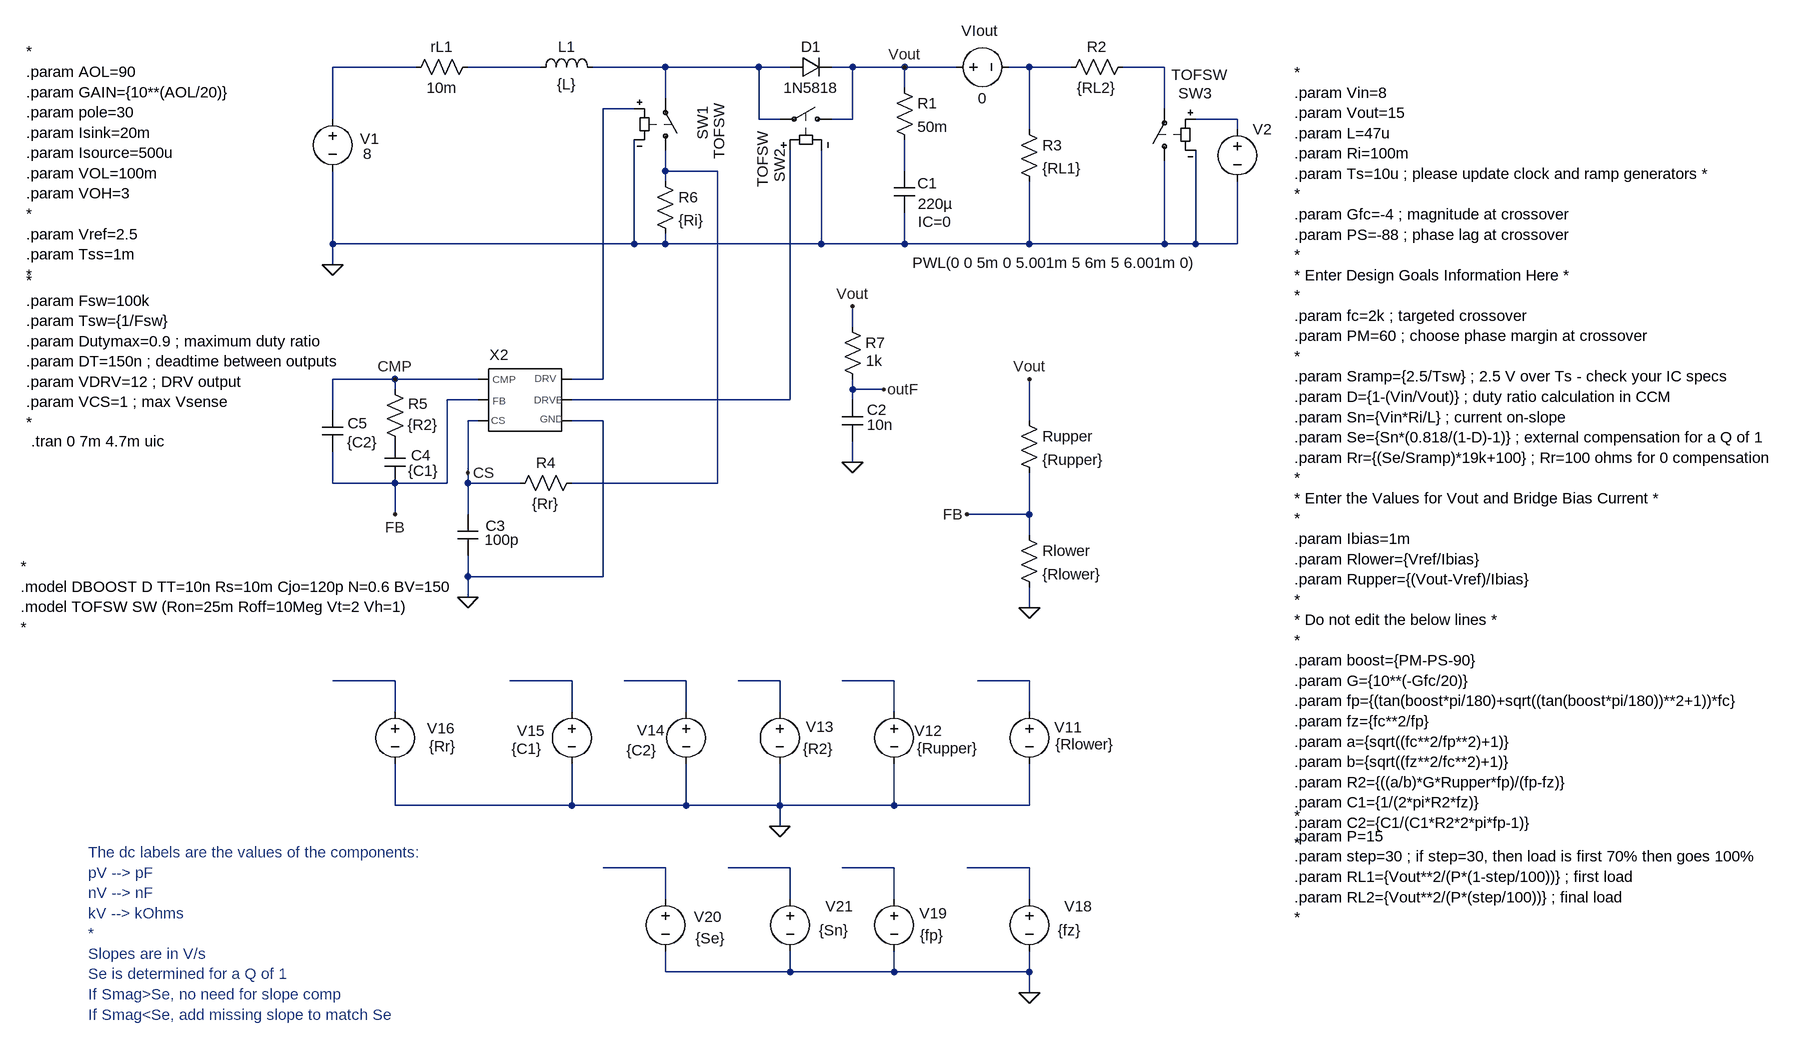
[diagram p0: schematic Boost Synchro CM - cbc - load step.asc]
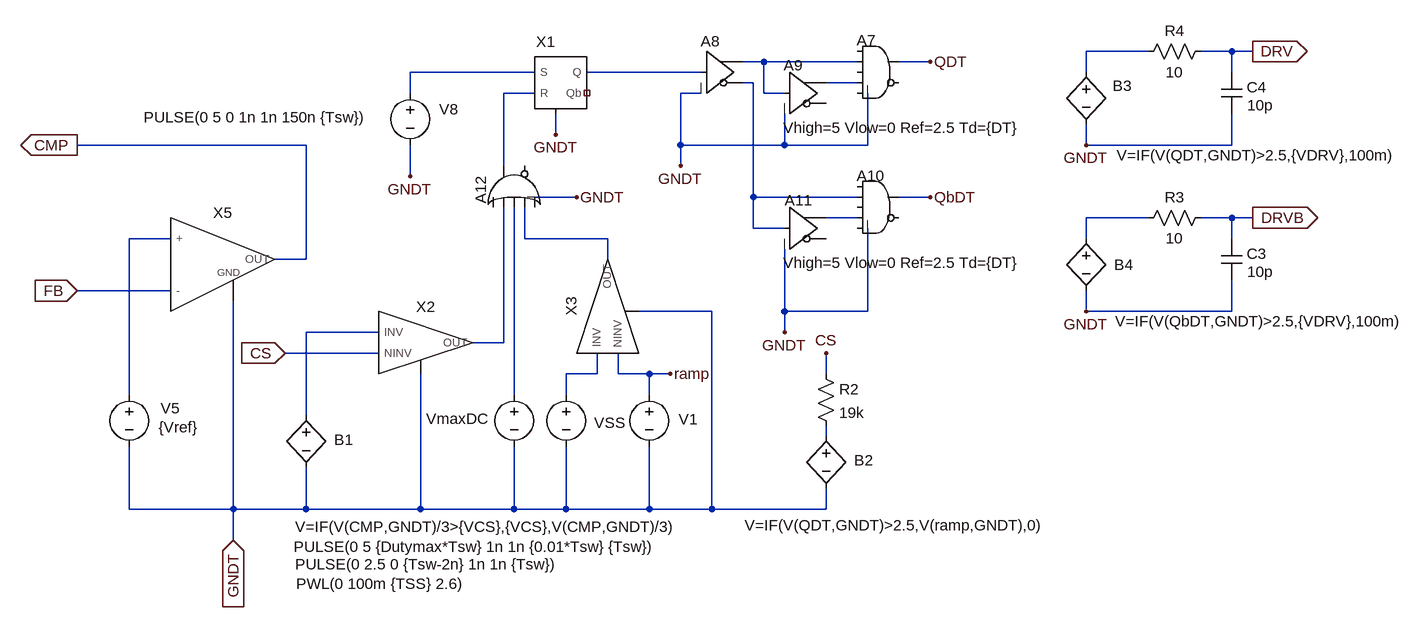
[diagram p1: sub-circuit generic_cm_pwm.asc]
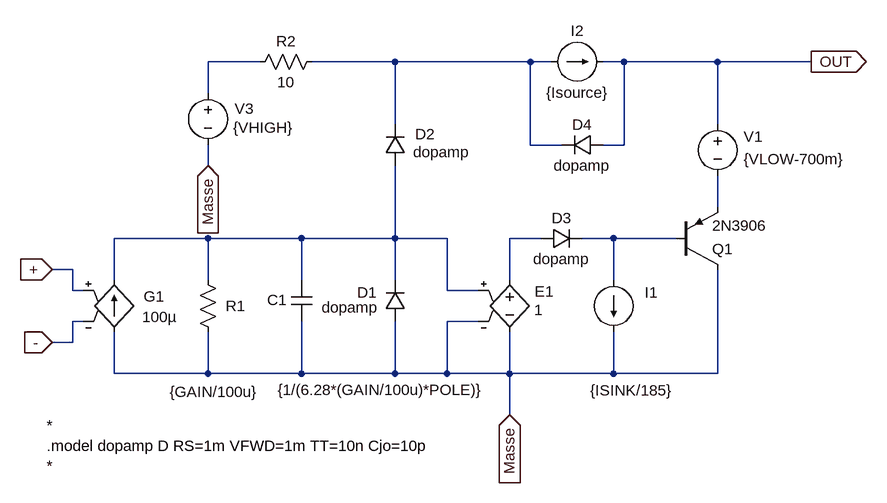
[diagram p2: sub-circuit op_amp_fan_out.asc]
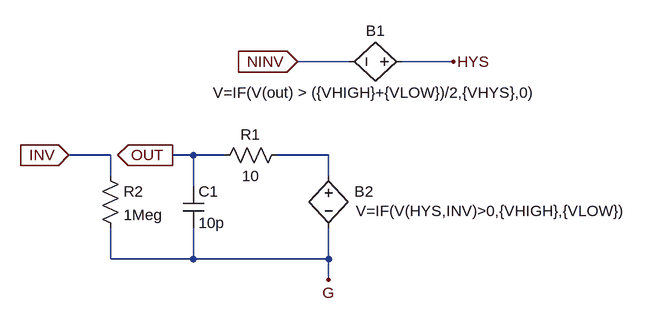
[diagram p3: sub-circuit comptof_g.asc]
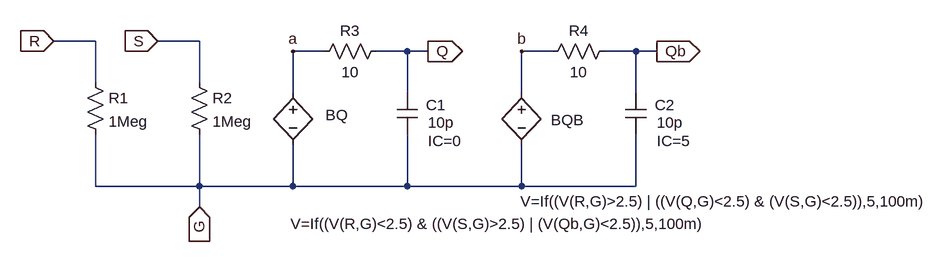
[diagram p4: sub-circuit sr_latch_g.asc]
Boost Synchro CM - cbc - load step.asc, the LTspice schematic file:
Version 4.1
SHEET 1 3080 1960
WIRE -16 224 -144 224
WIRE 176 224 64 224
WIRE 368 224 256 224
WIRE 512 224 368 224
WIRE 560 224 512 224
WIRE 656 224 624 224
WIRE 736 224 656 224
WIRE 816 224 736 224
WIRE 928 224 896 224
WIRE 992 224 928 224
WIRE 1136 224 1072 224
WIRE 736 256 736 224
WIRE 368 272 368 224
WIRE 320 288 272 288
WIRE 1136 288 1136 224
WIRE -144 304 -144 224
WIRE 512 304 512 224
WIRE 544 304 512 304
WIRE 656 304 656 224
WIRE 656 304 624 304
WIRE 1248 304 1184 304
WIRE 928 320 928 224
WIRE 1248 320 1248 304
WIRE 368 384 368 352
WIRE 448 384 368 384
WIRE 736 384 736 336
WIRE 368 400 368 384
WIRE -144 496 -144 384
WIRE 320 496 320 336
WIRE 320 496 -144 496
WIRE 368 496 368 480
WIRE 368 496 320 496
WIRE 608 496 608 352
WIRE 608 496 368 496
WIRE 736 496 736 448
WIRE 736 496 608 496
WIRE 928 496 928 400
WIRE 928 496 736 496
WIRE 1136 496 1136 368
WIRE 1136 496 928 496
WIRE 1184 496 1184 352
WIRE 1184 496 1136 496
WIRE 1248 496 1248 400
WIRE 1248 496 1184 496
WIRE -144 528 -144 496
WIRE 656 624 656 592
WIRE -48 704 -144 704
WIRE 80 704 -48 704
WIRE 272 704 272 288
WIRE 272 704 224 704
WIRE -48 720 -48 704
WIRE 656 720 656 704
WIRE 704 720 656 720
WIRE 80 736 32 736
WIRE 560 736 560 352
WIRE 560 736 224 736
WIRE 656 736 656 720
WIRE -144 752 -144 704
WIRE 80 768 64 768
WIRE 272 768 224 768
WIRE 928 768 928 704
WIRE 656 832 656 800
WIRE 64 848 64 768
WIRE -144 864 -144 816
WIRE -48 864 -144 864
WIRE 32 864 32 736
WIRE 32 864 -48 864
WIRE 64 864 64 848
WIRE 144 864 64 864
WIRE 448 864 448 384
WIRE 448 864 224 864
WIRE -48 912 -48 864
WIRE 64 912 64 864
WIRE 928 912 928 848
WIRE 928 912 832 912
WIRE 928 944 928 912
WIRE 64 1008 64 976
WIRE 272 1008 272 768
WIRE 272 1008 64 1008
WIRE 64 1040 64 1008
WIRE 928 1056 928 1024
WIRE -48 1168 -144 1168
WIRE 224 1168 128 1168
WIRE 400 1168 304 1168
WIRE 544 1168 480 1168
WIRE 720 1168 640 1168
WIRE 928 1168 848 1168
WIRE -48 1216 -48 1168
WIRE 224 1216 224 1168
WIRE 400 1216 400 1168
WIRE 544 1216 544 1168
WIRE 720 1216 720 1168
WIRE 928 1216 928 1168
WIRE -48 1360 -48 1296
WIRE 224 1360 224 1296
WIRE 224 1360 -48 1360
WIRE 400 1360 400 1296
WIRE 400 1360 224 1360
WIRE 544 1360 544 1296
WIRE 544 1360 400 1360
WIRE 720 1360 720 1296
WIRE 720 1360 544 1360
WIRE 928 1360 928 1296
WIRE 928 1360 720 1360
WIRE 544 1392 544 1360
WIRE 368 1456 272 1456
WIRE 560 1456 464 1456
WIRE 720 1456 640 1456
WIRE 928 1456 832 1456
WIRE 368 1504 368 1456
WIRE 560 1504 560 1456
WIRE 720 1504 720 1456
WIRE 928 1504 928 1456
WIRE 368 1616 368 1584
WIRE 560 1616 560 1584
WIRE 560 1616 368 1616
WIRE 720 1616 720 1584
WIRE 720 1616 560 1616
WIRE 928 1616 928 1584
WIRE 928 1616 720 1616
WIRE 928 1648 928 1616
FLAG -144 528 0
FLAG 928 1056 0
FLAG 928 704 Vout
FLAG 832 912 FB
FLAG 736 224 Vout
FLAG -48 912 FB
FLAG -48 704 CMP
FLAG 64 1040 0
FLAG 64 848 CS
FLAG 544 1392 0
FLAG 928 1648 0
FLAG 656 592 Vout
FLAG 656 832 0
FLAG 704 720 outF
DATAFLAG 144 1168 ""
DATAFLAG 336 1168 ""
DATAFLAG 512 1168 ""
DATAFLAG 656 1168 ""
DATAFLAG 880 1168 ""
DATAFLAG -112 1168 ""
DATAFLAG 848 1456 ""
DATAFLAG 688 1456 ""
DATAFLAG 304 1456 ""
DATAFLAG 480 1456 ""
SYMBOL sw 368 368 M180
WINDOW 3 83 89 VLeft 2
WINDOW 0 57 84 VLeft 2
SYMATTR Value TOFSW
SYMATTR InstName SW1
SYMBOL voltage -144 288 R0
WINDOW 0 42 46 Left 2
WINDOW 3 47 69 Left 2
SYMATTR InstName V1
SYMATTR Value 8
SYMBOL diode 560 240 R270
WINDOW 0 32 32 VTop 2
WINDOW 3 0 32 VBottom 2
SYMATTR InstName D1
SYMATTR Value 1N5818
SYMBOL res 80 208 R90
WINDOW 0 0 56 VBottom 2
WINDOW 3 32 56 VTop 2
SYMATTR InstName rL1
SYMATTR Value 10m
SYMBOL ind 160 240 R270
WINDOW 0 32 56 VTop 2
WINDOW 3 5 56 VBottom 2
SYMATTR InstName L1
SYMATTR Value {L}
SYMBOL res 720 240 R0
SYMATTR InstName R1
SYMATTR Value 50m
SYMBOL cap 720 384 R0
WINDOW 0 36 19 Left 2
WINDOW 3 37 50 Left 2
WINDOW 123 37 78 Left 2
SYMATTR InstName C1
SYMATTR Value 220µ
SYMATTR Value2 IC=0
SYMBOL res 912 304 R0
SYMATTR InstName R3
SYMATTR Value {RL1}
SYMBOL voltage 800 224 R270
WINDOW 0 40 52 VTop 2
WINDOW 3 -32 56 VBottom 2
SYMATTR InstName VIout
SYMATTR Value 0
SYMBOL res 912 928 R0
SYMATTR InstName Rlower
SYMATTR Value {Rlower}
SYMBOL res 912 752 R0
SYMATTR InstName Rupper
SYMATTR Value {Rupper}
SYMBOL res 240 848 R90
WINDOW 0 0 56 VBottom 2
WINDOW 3 32 56 VTop 2
SYMATTR InstName R4
SYMATTR Value {Rr}
SYMBOL cap 48 912 R0
WINDOW 0 43 18 Left 2
WINDOW 3 42 39 Left 2
SYMATTR InstName C3
SYMATTR Value 100p
SYMBOL cap -64 800 R0
WINDOW 0 41 21 Left 2
WINDOW 3 36 45 Left 2
SYMATTR InstName C4
SYMATTR Value {C1}
SYMBOL res -64 704 R0
WINDOW 0 36 38 Left 2
WINDOW 3 35 70 Left 2
SYMATTR InstName R5
SYMATTR Value {R2}
SYMBOL cap -160 752 R0
WINDOW 0 39 20 Left 2
WINDOW 3 38 49 Left 2
SYMATTR InstName C5
SYMATTR Value {C2}
SYMBOL sw 640 304 M270
WINDOW 3 -18 122 Right 2
WINDOW 0 -46 96 Right 2
SYMATTR Value TOFSW
SYMATTR InstName SW2
SYMBOL res 352 384 R0
SYMATTR InstName R6
SYMATTR Value {Ri}
SYMBOL voltage 928 1200 R0
WINDOW 0 39 40 Left 2
WINDOW 3 40 66 Left 2
WINDOW 123 0 0 Left 0
WINDOW 39 0 0 Left 0
SYMATTR InstName V11
SYMATTR Value {Rlower}
SYMBOL voltage 720 1200 R0
WINDOW 0 31 45 Left 2
WINDOW 3 35 72 Left 2
WINDOW 123 0 0 Left 0
WINDOW 39 0 0 Left 0
SYMATTR InstName V12
SYMATTR Value {Rupper}
SYMBOL voltage 544 1200 R0
WINDOW 0 40 39 Left 2
WINDOW 3 36 73 Left 2
WINDOW 123 0 0 Left 0
WINDOW 39 0 0 Left 0
SYMATTR InstName V13
SYMATTR Value {R2}
SYMBOL voltage 400 1200 R0
WINDOW 0 -76 44 Left 2
WINDOW 3 -92 75 Left 2
SYMATTR InstName V14
SYMATTR Value {C2}
SYMBOL voltage 224 1200 R0
WINDOW 0 -84 45 Left 2
WINDOW 3 -93 73 Left 2
WINDOW 123 0 0 Left 0
WINDOW 39 0 0 Left 0
SYMATTR InstName V15
SYMATTR Value {C1}
SYMBOL voltage -48 1200 R0
WINDOW 0 49 41 Left 2
WINDOW 3 52 69 Left 2
SYMATTR InstName V16
SYMATTR Value {Rr}
SYMBOL voltage 928 1488 R0
WINDOW 0 54 27 Left 2
WINDOW 3 44 64 Left 2
WINDOW 123 0 0 Left 0
WINDOW 39 0 0 Left 0
SYMATTR InstName V18
SYMATTR Value {fz}
SYMBOL voltage 720 1488 R0
WINDOW 0 39 38 Left 2
WINDOW 3 40 72 Left 2
SYMATTR InstName V19
SYMATTR Value {fp}
SYMBOL voltage 368 1488 R0
WINDOW 0 44 43 Left 2
WINDOW 3 46 76 Left 2
SYMATTR InstName V20
SYMATTR Value {Se}
SYMBOL voltage 560 1488 R0
WINDOW 0 54 27 Left 2
WINDOW 3 44 64 Left 2
WINDOW 123 0 0 Left 0
WINDOW 39 0 0 Left 0
SYMATTR InstName V21
SYMATTR Value {Sn}
SYMBOL res 1088 208 R90
WINDOW 0 0 56 VBottom 2
WINDOW 3 32 56 VTop 2
SYMATTR InstName R2
SYMATTR Value {RL2}
SYMBOL sw 1136 384 R180
WINDOW 3 -98 148 Left 2
WINDOW 0 -73 120 Left 2
SYMATTR Value TOFSW
SYMATTR InstName SW3
SYMBOL voltage 1248 304 R0
WINDOW 3 -500 221 Left 2
WINDOW 123 0 0 Left 0
WINDOW 39 0 0 Left 0
SYMATTR Value PWL(0 0 5m 0 5.001m 5 6m 5 6.001m 0)
SYMATTR InstName V2
SYMBOL res 640 608 R0
WINDOW 3 37 68 Left 2
SYMATTR Value 1k
SYMATTR InstName R7
SYMBOL cap 640 736 R0
WINDOW 0 38 15 Left 2
WINDOW 3 38 38 Left 2
SYMATTR InstName C2
SYMATTR Value 10n
SYMBOL TOF\\Subcircuits\\Generic_CM_PWM 144 704 R0
WINDOW 0 -32 -22 Bottom 2
SYMATTR InstName X2
SYMATTR SpiceLine gain={gain} pole={pole} Isink={Isink} Isource={Isource} Vlow={VOL} Vhigh={VOH}
TEXT -624 992 Left 2 !*\n.model DBOOST D TT=10n Rs=10m Cjo=120p N=0.6 BV=150\n.model TOFSW SW (Ron=25m Roff=10Meg Vt=2 Vh=1)\n*
TEXT -608 800 Left 2 !.tran 0 7m 4.7m uic
TEXT 1336 232 Left 2 !*\n.param Vin=8\n.param Vout=15\n.param L=47u\n.param Ri=100m\n.param Ts=10u ; please update clock and ramp generators *\n*\n.param Gfc=-4 ; magnitude at crossover\n.param PS=-88 ; phase lag at crossover\n*\n* Enter Design Goals Information Here *\n*\n.param fc=2k ; targeted crossover\n.param PM=60 ; choose phase margin at crossover\n*\n.param Sramp={2.5/Tsw} ; 2.5 V over Ts - check your IC specs\n.param D={1-(Vin/Vout)} ; duty ratio calculation in CCM\n.param Sn={Vin*Ri/L} ; current on-slope\n.param Se={Sn*(0.818/(1-D)-1)} ; external compensation for a Q of 1\n.param Rr={(Se/Sramp)*19k+100} ; Rr=100 ohms for 0 compensation\n*\n* Enter the Values for Vout and Bridge Bias Current *\n*\n.param Ibias=1m\n.param Rlower={Vref/Ibias}\n.param Rupper={(Vout-Vref)/Ibias}\n*\n* Do not edit the below lines *\n*\n.param boost={PM-PS-90}\n.param G={10**(-Gfc/20)}\n.param fp={(tan(boost*pi/180)+sqrt((tan(boost*pi/180))**2+1))*fc}\n.param fz={fc**2/fp}\n.param a={sqrt((fc**2/fp**2)+1)}\n.param b={sqrt((fz**2/fc**2)+1)}\n.param R2={((a/b)*G*Rupper*fp)/(fp-fz)}\n.param C1={1/(2*pi*R2*fz)}\n.param C2={C1/(C1*R2*2*pi*fp-1)}\n*
TEXT -520 1432 Left 2 ;The dc labels are the values of the components:\npV --> pF\nnV --> nF\nkV --> kOhms\n*\nSlopes are in V/s\nSe is determined for a Q of 1\nIf Smag>Se, no need for slope comp\nIf Smag<Se, add missing slope to match Se
TEXT -616 552 Left 2 !*\n.param Fsw=100k\n.param Tsw={1/Fsw}\n.param Dutymax=0.9 ; maximum duty ratio\n.param DT=150n ; deadtime between outputs\n.param VDRV=12 ; DRV output\n.param VCS=1 ; max Vsense\n*
TEXT -616 200 Left 2 !* \n.param AOL=90\n.param GAIN={10**(AOL/20)}\n.param pole=30\n.param Isink=20m\n.param Isource=500u\n.param VOL=100m\n.param VOH=3\n*\n.param Vref=2.5\n.param Tss=1m\n*
TEXT 1336 1376 Left 2 !*\n.param P=15\n.param step=30 ; if step=30, then load is first 70% then goes 100%\n.param RL1={Vout**2/(P*(1-step/100))} ; first load\n.param RL2={Vout**2/(P*(step/100))} ; final load\n*

generic_cm_pwm.asc, the sub-circuit schematic file:
Version 4.1
SHEET 1 1744 1720
WIRE 448 816 352 816
WIRE 576 816 528 816
WIRE 608 816 576 816
WIRE -144 832 -176 832
WIRE 0 832 -144 832
WIRE 112 832 64 832
WIRE -496 848 -688 848
WIRE -240 848 -416 848
WIRE 352 848 352 816
WIRE 576 848 576 816
WIRE -160 864 -176 864
WIRE 0 864 -48 864
WIRE -688 880 -688 848
WIRE -496 880 -544 880
WIRE -240 880 -272 880
WIRE -144 880 -144 832
WIRE -112 880 -144 880
WIRE -464 944 -464 912
WIRE -848 960 -1200 960
WIRE -272 960 -272 880
WIRE -112 960 -112 912
WIRE -112 960 -272 960
WIRE 16 960 16 880
WIRE 16 960 -112 960
WIRE 352 960 352 928
WIRE 576 960 576 912
WIRE 576 960 352 960
WIRE -544 992 -544 880
WIRE -272 992 -272 960
WIRE -688 1008 -688 960
WIRE -432 1040 -496 1040
WIRE -160 1040 -160 864
WIRE 0 1040 -160 1040
WIRE 112 1040 64 1040
WIRE 0 1072 -48 1072
WIRE 448 1072 352 1072
WIRE 576 1072 528 1072
WIRE 608 1072 576 1072
WIRE -160 1088 -160 1040
WIRE -112 1088 -160 1088
WIRE -1056 1104 -1120 1104
WIRE -512 1104 -512 1056
WIRE -384 1104 -512 1104
WIRE 352 1104 352 1072
WIRE 576 1104 576 1072
WIRE -848 1136 -848 960
WIRE -848 1136 -896 1136
WIRE -384 1136 -384 1104
WIRE -1056 1184 -1200 1184
WIRE -224 1216 -336 1216
WIRE -112 1216 -112 1120
WIRE 16 1216 16 1088
WIRE 16 1216 -112 1216
WIRE 352 1216 352 1184
WIRE 576 1216 576 1168
WIRE 576 1216 352 1216
WIRE -736 1248 -848 1248
WIRE -112 1248 -112 1216
WIRE -544 1264 -544 1056
WIRE -544 1264 -592 1264
WIRE -736 1280 -880 1280
WIRE -400 1312 -400 1280
WIRE -400 1312 -448 1312
WIRE -368 1312 -368 1280
WIRE -320 1312 -368 1312
WIRE -288 1312 -320 1312
WIRE -48 1312 -48 1280
WIRE -1120 1344 -1120 1104
WIRE -528 1344 -528 1056
WIRE -448 1344 -448 1312
WIRE -320 1344 -320 1312
WIRE -848 1376 -848 1248
WIRE -48 1408 -48 1392
WIRE -1120 1520 -1120 1424
WIRE -960 1520 -960 1200
WIRE -960 1520 -1120 1520
WIRE -848 1520 -848 1456
WIRE -848 1520 -960 1520
WIRE -672 1520 -672 1312
WIRE -672 1520 -848 1520
WIRE -528 1520 -528 1424
WIRE -528 1520 -672 1520
WIRE -448 1520 -448 1424
WIRE -448 1520 -528 1520
WIRE -320 1520 -320 1424
WIRE -320 1520 -448 1520
WIRE -224 1520 -224 1216
WIRE -224 1520 -320 1520
WIRE -48 1520 -48 1488
WIRE -48 1520 -224 1520
WIRE -960 1568 -960 1520
FLAG 112 832 QDT
FLAG 112 1040 QbDT
FLAG 352 1216 GNDT
FLAG 352 960 GNDT
FLAG 608 1072 DRVB
IOPIN 608 1072 Out
FLAG 608 816 DRV
IOPIN 608 816 Out
FLAG -1200 960 CMP
IOPIN -1200 960 Out
FLAG -1200 1184 FB
IOPIN -1200 1184 In
FLAG -880 1280 CS
IOPIN -880 1280 In
FLAG -960 1568 GNDT
IOPIN -960 1568 In
FLAG -688 1008 GNDT
FLAG -112 1248 GNDT
FLAG -272 992 GNDT
FLAG -464 944 GNDT
FLAG -432 1040 GNDT
FLAG -288 1312 ramp
FLAG -48 1280 CS
SYMBOL Digital\\and 32 784 R0
WINDOW 0 -33 15 Left 2
SYMATTR InstName A7
SYMATTR SpiceLine Vhigh=5 Vlow=0 Ref=2.5
SYMBOL Digital\\buf -240 784 R0
WINDOW 0 -1 16 Left 2
SYMATTR InstName A8
SYMATTR SpiceLine Vhigh=5 Vlow=0 Ref=1.0
SYMBOL Digital\\buf -112 816 R0
WINDOW 0 -1 21 Left 2
WINDOW 39 -2 117 Left 2
SYMATTR InstName A9
SYMATTR SpiceLine Vhigh=5 Vlow=0 Ref=2.5 Td={DT}
SYMBOL Digital\\and 32 992 R0
WINDOW 0 -33 15 Left 2
SYMATTR InstName A10
SYMATTR SpiceLine Vhigh=5 Vlow=0 Ref=2.5
SYMBOL Digital\\buf -112 1024 R0
WINDOW 0 0 21 Left 2
WINDOW 39 -2 117 Left 2
SYMATTR InstName A11
SYMATTR SpiceLine Vhigh=5 Vlow=0 Ref=2.5 Td={DT}
SYMBOL bv 352 832 R0
WINDOW 0 41 37 Left 2
WINDOW 3 47 144 Left 2
SYMATTR InstName B3
SYMATTR Value V=IF(V(QDT,GNDT)>2.5,{VDRV},100m)
SYMBOL bv 352 1088 R0
WINDOW 0 43 56 Left 2
WINDOW 3 45 143 Left 2
SYMATTR InstName B4
SYMATTR Value V=IF(V(QbDT,GNDT)>2.5,{VDRV},100m)
SYMBOL res 544 1056 R90
WINDOW 0 0 56 VBottom 2
WINDOW 3 32 56 VTop 2
SYMATTR InstName R3
SYMATTR Value 10
SYMBOL cap 560 1104 R0
WINDOW 0 39 23 Left 2
WINDOW 3 40 51 Left 2
SYMATTR InstName C3
SYMATTR Value 10p
SYMBOL res 544 800 R90
WINDOW 0 0 56 VBottom 2
WINDOW 3 32 56 VTop 2
SYMATTR InstName R4
SYMATTR Value 10
SYMBOL cap 560 848 R0
WINDOW 0 39 23 Left 2
WINDOW 3 40 51 Left 2
SYMATTR InstName C4
SYMATTR Value 10p
SYMBOL op_amp_fan_out -976 1136 R0
SYMATTR InstName X5
SYMATTR SpiceLine gain={gain} pole={pole} Isink={Isink} Isource={Isource} Vlow={VOL} Vhigh={VOH}
SYMBOL Digital\\or -592 1024 R270
WINDOW 0 -27 13 Left 2
SYMATTR InstName A12
SYMATTR SpiceLine Vhigh=5 Vlow=0 Ref=2.5
SYMBOL voltage -1120 1328 R0
WINDOW 0 48 37 Left 2
WINDOW 3 45 66 Left 2
SYMATTR InstName V5
SYMATTR Value {Vref}
SYMBOL voltage -688 864 R0
WINDOW 0 45 41 Left 2
WINDOW 3 -410 53 Left 2
WINDOW 123 0 0 Left 0
WINDOW 39 0 0 Left 0
SYMATTR InstName V8
SYMATTR Value PULSE(0 5 0 1n 1n 150n {Tsw})
SYMBOL voltage -528 1328 R0
WINDOW 0 -135 53 Left 2
WINDOW 3 -339 250 Left 2
WINDOW 123 0 0 Left 0
WINDOW 39 0 0 Left 0
SYMATTR InstName VmaxDC
SYMATTR Value PULSE(0 5 {Dutymax*Tsw} 1n 1n {0.01*Tsw} {Tsw})
SYMBOL bv -848 1360 R0
WINDOW 0 43 53 Left 2
WINDOW 3 -17 187 Left 2
SYMATTR InstName B1
SYMATTR Value V=IF(V(CMP,GNDT)/3>{VCS},{VCS},V(CMP,GNDT)/3)
SYMBOL voltage -320 1328 R0
WINDOW 0 45 54 Left 2
WINDOW 3 -545 277 Left 2
WINDOW 123 0 0 Left 0
WINDOW 39 0 0 Left 0
SYMATTR InstName V1
SYMATTR Value PULSE(0 2.5 0 {Tsw-2n} 1n 1n {Tsw})
SYMBOL voltage -448 1328 R0
WINDOW 0 43 59 Left 2
WINDOW 3 -415 307 Left 2
WINDOW 123 0 0 Left 0
WINDOW 39 0 0 Left 0
SYMATTR InstName VSS
SYMATTR Value PWL(0 100m {TSS} 2.6)
SYMBOL res -64 1296 R0
SYMATTR InstName R2
SYMATTR Value 19k
SYMBOL bv -48 1392 R0
WINDOW 0 43 53 Left 2
WINDOW 3 -125 153 Left 2
SYMATTR InstName B2
SYMATTR Value V=IF(V(QDT,GNDT)>2.5,V(ramp,GNDT),0)
SYMBOL TOF\\Subcircuits\\COMPTOF_G -672 1264 R0
SYMATTR InstName X2
SYMATTR SpiceLine VHIGH=5 VLOW=100m VHYS=10m
SYMBOL TOF\\Subcircuits\\COMPTOF_G -384 1216 R270
SYMATTR InstName X3
SYMATTR SpiceLine VHIGH=5 VLOW=100m VHYS=10m
SYMBOL TOF\\Subcircuits\\SR_latch_G -464 864 R0
WINDOW 0 -15 -47 Bottom 2
SYMATTR InstName X1

op_amp_fan_out.asc, the sub-circuit schematic file:
Version 4.1
SHEET 1 1504 680
WIRE 96 -224 16 -224
WIRE 304 -224 176 -224
WIRE 512 -224 304 -224
WIRE 544 -224 512 -224
WIRE 656 -224 624 -224
WIRE 800 -224 656 -224
WIRE 944 -224 800 -224
WIRE 16 -176 16 -224
WIRE 304 -128 304 -224
WIRE 800 -128 800 -224
WIRE 512 -96 512 -224
WIRE 560 -96 512 -96
WIRE 656 -96 656 -224
WIRE 656 -96 624 -96
WIRE 16 -64 16 -96
WIRE 800 0 800 -48
WIRE 16 48 -128 48
WIRE 160 48 16 48
WIRE 304 48 304 -64
WIRE 304 48 160 48
WIRE 384 48 304 48
WIRE 528 48 480 48
WIRE 640 48 592 48
WIRE 736 48 640 48
WIRE -192 96 -224 96
WIRE -128 112 -128 48
WIRE 16 112 16 48
WIRE 160 112 160 48
WIRE 304 112 304 48
WIRE 480 112 480 48
WIRE 640 112 640 48
WIRE -192 128 -192 96
WIRE -176 128 -192 128
WIRE 384 128 384 48
WIRE 432 128 384 128
WIRE -176 176 -192 176
WIRE 432 176 384 176
WIRE -192 208 -192 176
WIRE -192 208 -224 208
WIRE -128 256 -128 192
WIRE 16 256 16 192
WIRE 16 256 -128 256
WIRE 160 256 160 176
WIRE 160 256 16 256
WIRE 304 256 304 176
WIRE 304 256 160 256
WIRE 384 256 384 176
WIRE 384 256 304 256
WIRE 480 256 480 192
WIRE 480 256 384 256
WIRE 640 256 640 192
WIRE 640 256 480 256
WIRE 800 256 800 96
WIRE 800 256 640 256
WIRE 480 320 480 256
FLAG -224 96 +
IOPIN -224 96 In
FLAG -224 208 -
IOPIN -224 208 In
FLAG 944 -224 OUT
IOPIN 944 -224 Out
FLAG 480 320 Masse
IOPIN 480 320 In
FLAG 16 -64 Masse
IOPIN 16 -64 In
DATAFLAG 800 -16 ""
SYMBOL g -128 96 R0
WINDOW 0 45 41 Left 2
WINDOW 3 43 73 Left 2
SYMATTR InstName G1
SYMATTR Value 100µ
SYMBOL res 0 96 R0
WINDOW 0 43 56 Left 2
WINDOW 3 -43 188 Left 2
SYMATTR InstName R1
SYMATTR Value {GAIN/100u}
SYMBOL cap 144 112 R0
WINDOW 0 -37 31 Left 2
WINDOW 3 -21 169 Left 2
SYMATTR InstName C1
SYMATTR Value {1/(6.28*(GAIN/100u)*POLE)}
SYMBOL diode 320 176 R180
WINDOW 0 44 45 Left 2
WINDOW 3 41 22 Left 2
SYMATTR InstName D1
SYMATTR Value dopamp
SYMBOL e 480 96 R0
WINDOW 0 39 34 Left 2
WINDOW 3 38 62 Left 2
SYMATTR InstName E1
SYMATTR Value 1
SYMBOL diode 528 64 R270
WINDOW 0 32 32 VTop 2
WINDOW 3 0 32 VBottom 2
SYMATTR InstName D3
SYMATTR Value dopamp
SYMBOL current 640 112 R0
WINDOW 0 48 19 Left 2
WINDOW 3 -36 170 Left 2
SYMATTR InstName I1
SYMATTR Value {ISINK/185}
SYMBOL pnp 736 96 M180
SYMATTR InstName Q1
SYMATTR Value 2N3906
SYMBOL voltage 800 -144 R0
WINDOW 0 40 35 Left 2
WINDOW 3 40 70 Left 2
SYMATTR InstName V1
SYMATTR Value {VLOW-700m}
SYMBOL current 544 -224 R270
WINDOW 0 32 40 VTop 2
WINDOW 3 -32 40 VBottom 2
SYMATTR InstName I2
SYMATTR Value {Isource}
SYMBOL diode 624 -80 M270
WINDOW 0 32 32 VTop 2
WINDOW 3 0 32 VBottom 2
SYMATTR InstName D4
SYMATTR Value dopamp
SYMBOL voltage 16 -192 R0
WINDOW 0 41 40 Left 2
WINDOW 3 39 69 Left 2
SYMATTR InstName V3
SYMATTR Value {VHIGH}
SYMBOL diode 288 -64 M180
WINDOW 0 47 49 Left 2
WINDOW 3 44 21 Left 2
SYMATTR InstName D2
SYMATTR Value dopamp
SYMBOL res 192 -240 R90
WINDOW 0 0 56 VBottom 2
WINDOW 3 32 56 VTop 2
SYMATTR InstName R2
SYMATTR Value 10
TEXT -232 336 Left 2 !*\n.model dopamp D RS=1m VFWD=1m TT=10n Cjo=10p\n*

comptof_g.asc, the sub-circuit schematic file:
Version 4.1
SHEET 1 880 680
WIRE 64 192 -16 192
WIRE 224 192 144 192
WIRE -304 336 -368 336
WIRE -176 336 -208 336
WIRE -128 336 -176 336
WIRE 32 336 -48 336
WIRE -304 368 -304 336
WIRE 32 368 32 336
WIRE -176 384 -176 336
WIRE -304 496 -304 448
WIRE -176 496 -176 448
WIRE -176 496 -304 496
WIRE 32 496 32 448
WIRE 32 496 -176 496
WIRE 32 528 32 496
FLAG -16 192 NINV
IOPIN -16 192 In
FLAG 224 192 HYS
FLAG -208 336 OUT
IOPIN -208 336 Out
FLAG -368 336 INV
IOPIN -368 336 In
FLAG 32 528 G
SYMBOL bv 160 192 R90
WINDOW 0 -32 56 VBottom 2
WINDOW 3 32 56 VTop 2
SYMATTR InstName B1
SYMATTR Value V=IF(V(out) > ({VHIGH}+{VLOW})/2,{VHYS},0)
SYMBOL bv 32 352 R0
WINDOW 0 40 40 Left 2
WINDOW 3 42 70 Left 2
SYMATTR InstName B2
SYMATTR Value V=IF(V(HYS,INV)>0,{VHIGH},{VLOW})
SYMBOL res -32 320 R90
WINDOW 0 0 56 VBottom 2
WINDOW 3 32 56 VTop 2
SYMATTR InstName R1
SYMATTR Value 10
SYMBOL cap -192 384 R0
SYMATTR InstName C1
SYMATTR Value 10p
SYMBOL res -320 352 R0
SYMATTR InstName R2
SYMATTR Value 1Meg

sr_latch_g.asc, the sub-circuit schematic file:
Version 4.1
SHEET 1 1168 680
WIRE -192 48 -256 48
WIRE -32 48 -96 48
WIRE 160 64 112 64
WIRE 288 64 240 64
WIRE 320 64 288 64
WIRE 512 64 464 64
WIRE 640 64 592 64
WIRE 672 64 640 64
WIRE -192 112 -192 48
WIRE -32 112 -32 48
WIRE 112 128 112 64
WIRE 288 128 288 64
WIRE 464 128 464 64
WIRE 640 128 640 64
WIRE -192 272 -192 192
WIRE -32 272 -32 192
WIRE -32 272 -192 272
WIRE 112 272 112 208
WIRE 112 272 -32 272
WIRE 288 272 288 192
WIRE 288 272 112 272
WIRE 464 272 464 208
WIRE 464 272 288 272
WIRE 640 272 640 192
WIRE 640 272 464 272
WIRE -32 304 -32 272
FLAG -256 48 R
IOPIN -256 48 In
FLAG -96 48 S
IOPIN -96 48 In
FLAG 320 64 Q
IOPIN 320 64 Out
FLAG 672 64 Qb
IOPIN 672 64 Out
FLAG 112 64 a
FLAG 464 64 b
FLAG -32 304 G
IOPIN -32 304 In
SYMBOL bv 112 112 R0
WINDOW 0 50 50 Left 2
WINDOW 3 -4 218 Left 2
SYMATTR InstName BQ
SYMATTR Value V=If((V(R,G)<2.5) & ((V(S,G)>2.5) | (V(Qb,G)<2.5)),5,100m)
SYMBOL res -208 96 R0
SYMATTR InstName R1
SYMATTR Value 1Meg
SYMBOL res -48 96 R0
SYMATTR InstName R2
SYMATTR Value 1Meg
SYMBOL res 256 48 R90
WINDOW 0 0 56 VBottom 2
WINDOW 3 32 56 VTop 2
SYMATTR InstName R3
SYMATTR Value 10
SYMBOL cap 272 128 R0
WINDOW 0 45 19 Left 2
WINDOW 3 48 46 Left 2
WINDOW 123 48 74 Left 2
SYMATTR InstName C1
SYMATTR Value 10p
SYMATTR Value2 IC=0
SYMBOL bv 464 112 R0
WINDOW 0 45 58 Left 2
WINDOW 3 -2 183 Left 2
SYMATTR InstName BQB
SYMATTR Value V=If((V(R,G)>2.5) | ((V(Q,G)<2.5) & (V(S,G)<2.5)),5,100m)
SYMBOL res 608 48 R90
WINDOW 0 0 56 VBottom 2
WINDOW 3 32 56 VTop 2
SYMATTR InstName R4
SYMATTR Value 10
SYMBOL cap 624 128 R0
WINDOW 0 45 19 Left 2
WINDOW 3 48 46 Left 2
WINDOW 123 48 74 Left 2
SYMATTR InstName C2
SYMATTR Value 10p
SYMATTR Value2 IC=5

The netlist it stands for:
* Boost Synchro CM - cbc - load step.asc
SW1 N008 N003 N006 0 TOFSW
V1 N001 0 8
D1 N003 Vout 1N5818
rL1 N002 N001 10m
L1 N002 N003 {L}
R1 Vout N009 50m
C1 N009 0 220µ IC=0
R3 N004 0 {RL1}
VIout Vout N004 0
Rlower FB 0 {Rlower}
Rupper Vout FB {Rupper}
R4 N008 CS {Rr}
C3 CS 0 100p
C4 P001 FB {C1}
R5 CMP P001 {R2}
C5 CMP FB {C2}
SW2 Vout N003 N010 0 TOFSW
R6 N008 0 {Ri}
V11 N016 0 {Rlower}
V12 N015 0 {Rupper}
V13 N014 0 {R2}
V14 N013 0 {C2}
V15 N012 0 {C1}
V16 N011 0 {Rr}
V18 N020 0 {fz}
V19 N019 0 {fp}
V20 N017 0 {Se}
V21 N018 0 {Sn}
R2 N005 N004 {RL2}
SW3 0 N005 N007 0 TOFSW
V2 N007 0 PWL(0 0 5m 0 5.001m 5 6m 5 6.001m 0)
R7 Vout outF 1k
C2 outF 0 10n
X§X2 CS FB 0 CMP N006 N010 generic_cm_pwm params: gain={gain} pole={pole} Isink={Isink} Isource={Isource} Vlow={VOL} Vhigh={VOH}

* block symbol definitions
.subckt generic_cm_pwm CS FB GNDT CMP DRV DRVB
A7 GNDT N002 GNDT N006 GNDT GNDT QDT GNDT AND Vhigh=5 Vlow=0 Ref=2.5
A8 N004 GNDT GNDT GNDT GNDT N005 N002 GNDT BUF Vhigh=5 Vlow=0 Ref=1.0
A9 N002 GNDT GNDT GNDT GNDT GNDT N006 GNDT BUF Vhigh=5 Vlow=0 Ref=2.5 Td={DT}
A10 GNDT N005 GNDT N008 GNDT GNDT QbDT GNDT AND Vhigh=5 Vlow=0 Ref=2.5
A11 N005 GNDT GNDT GNDT GNDT GNDT N008 GNDT BUF Vhigh=5 Vlow=0 Ref=2.5 Td={DT}
B3 N001 GNDT V=IF(V(QDT,GNDT)>2.5,{VDRV},100m)
B4 N009 GNDT V=IF(V(QbDT,GNDT)>2.5,{VDRV},100m)
R3 DRVB N009 10
C3 DRVB GNDT 10p
R4 DRV N001 10
C4 DRV GNDT 10p
X§X5 N010 FB GNDT CMP op_amp_fan_out params: gain={gain} pole={pole} Isink={Isink} Isource={Isource} Vlow={VOL} Vhigh={VOH}
A12 GNDT N013 N015 N011 GNDT GNDT N007 GNDT OR Vhigh=5 Vlow=0 Ref=2.5
V5 N010 GNDT {Vref}
V8 N003 GNDT PULSE(0 5 0 1n 1n 150n {Tsw})
VmaxDC N015 GNDT PULSE(0 5 {Dutymax*Tsw} 1n 1n {0.01*Tsw} {Tsw})
B1 N012 GNDT V=IF(V(CMP,GNDT)/3>{VCS},{VCS},V(CMP,GNDT)/3)
V1 ramp GNDT PULSE(0 2.5 0 {Tsw-2n} 1n 1n {Tsw})
VSS N014 GNDT PWL(0 100m {TSS} 2.6)
R2 CS N016 19k
B2 N016 GNDT V=IF(V(QDT,GNDT)>2.5,V(ramp,GNDT),0)
X§X2 N012 CS N013 GNDT comptof_g params: VHIGH=5 VLOW=100m VHYS=10m
X§X3 N014 ramp N011 GNDT comptof_g params: VHIGH=5 VLOW=100m VHYS=10m
X§X1 N007 N003 N004 NC_01 GNDT sr_latch_g
.ends generic_cm_pwm

.subckt op_amp_fan_out + - Masse OUT
G1 Masse N004 + - 100µ
R1 N004 Masse {GAIN/100u}
C1 N004 Masse {1/(6.28*(GAIN/100u)*POLE)}
D1 Masse N004 dopamp
E1 N005 Masse N004 Masse 1
D3 N005 N006 dopamp
I1 N006 Masse {ISINK/185}
Q1 Masse N006 N003 0 2N3906
V1 OUT N003 {VLOW-700m}
I2 N002 OUT {Isource}
D4 OUT N002 dopamp
V3 N001 Masse {VHIGH}
D2 N004 N002 dopamp
R2 N002 N001 10
*
.model dopamp D RS=1m VFWD=1m TT=10n Cjo=10p
*
.ends op_amp_fan_out

.subckt comptof_g INV NINV OUT G
B1 HYS NINV V=IF(V(out) > ({VHIGH}+{VLOW})/2,{VHYS},0)
B2 N001 G V=IF(V(HYS,INV)>0,{VHIGH},{VLOW})
R1 N001 OUT 10
C1 OUT G 10p
R2 INV G 1Meg
.ends comptof_g

.subckt sr_latch_g R S Q Qb G
BQ a G V=If((V(R,G)<2.5) & ((V(S,G)>2.5) | (V(Qb,G)<2.5)),5,100m)
R1 R G 1Meg
R2 S G 1Meg
R3 Q a 10
C1 Q G 10p IC=0
BQB b G V=If((V(R,G)>2.5) | ((V(Q,G)<2.5) & (V(S,G)<2.5)),5,100m)
R4 Qb b 10
C2 Qb G 10p IC=5
.ends sr_latch_g

.model D D
.lib standard.dio
.model NPN NPN
.model PNP PNP
.lib standard.bjt
*
.model DBOOST D TT=10n Rs=10m Cjo=120p N=0.6 BV=150
.model TOFSW SW (Ron=25m Roff=10Meg Vt=2 Vh=1)
*
.tran 0 7m 4.7m uic
*
.param Vin=8
.param Vout=15
.param L=47u
.param Ri=100m
.param Ts=10u ; please update clock and ramp generators *
*
.param Gfc=-4 ; magnitude at crossover
.param PS=-88 ; phase lag at crossover
*
* Enter Design Goals Information Here *
*
.param fc=2k ; targeted crossover
.param PM=60 ; choose phase margin at crossover
*
.param Sramp={2.5/Tsw} ; 2.5 V over Ts - check your IC specs
.param D={1-(Vin/Vout)} ; duty ratio calculation in CCM
.param Sn={Vin*Ri/L} ; current on-slope
.param Se={Sn*(0.818/(1-D)-1)} ; external compensation for a Q of 1
.param Rr={(Se/Sramp)*19k+100} ; Rr=100 ohms for 0 compensation
*
* Enter the Values for Vout and Bridge Bias Current *
*
.param Ibias=1m
.param Rlower={Vref/Ibias}
.param Rupper={(Vout-Vref)/Ibias}
*
* Do not edit the below lines *
*
.param boost={PM-PS-90}
.param G={10**(-Gfc/20)}
.param fp={(tan(boost*pi/180)+sqrt((tan(boost*pi/180))**2+1))*fc}
.param fz={fc**2/fp}
.param a={sqrt((fc**2/fp**2)+1)}
.param b={sqrt((fz**2/fc**2)+1)}
.param R2={((a/b)*G*Rupper*fp)/(fp-fz)}
.param C1={1/(2*pi*R2*fz)}
.param C2={C1/(C1*R2*2*pi*fp-1)}
*
* The dc labels are the values of the components:
* pV --> pF
* nV --> nF
* kV --> kOhms
* *
* Slopes are in V/s
* Se is determined for a Q of 1
* If Smag>Se, no need for slope comp
* If Smag<Se, add missing slope to match Se
*
.param Fsw=100k
.param Tsw={1/Fsw}
.param Dutymax=0.9 ; maximum duty ratio
.param DT=150n ; deadtime between outputs
.param VDRV=12 ; DRV output
.param VCS=1 ; max Vsense
*
*
.param AOL=90
.param GAIN={10**(AOL/20)}
.param pole=30
.param Isink=20m
.param Isource=500u
.param VOL=100m
.param VOH=3
*
.param Vref=2.5
.param Tss=1m
*
*
.param P=15
.param step=30 ; if step=30, then load is first 70% then goes 100%
.param RL1={Vout**2/(P*(1-step/100))} ; first load
.param RL2={Vout**2/(P*(step/100))} ; final load
*
.backanno
.end